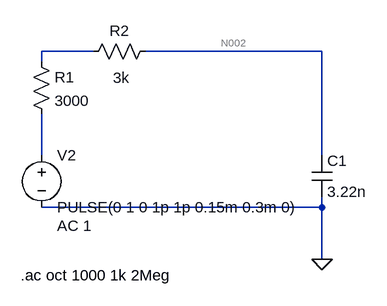
[diagram p0: schematic Draft3.asc]
Draft3.asc, the LTspice schematic file:
Version 4
SHEET 1 1096 680
WIRE 672 -48 592 -48
WIRE 1024 -48 752 -48
WIRE 592 -32 592 -48
WIRE 592 112 592 48
WIRE 1024 112 1024 -48
WIRE 1024 192 1024 176
WIRE 1024 192 592 192
WIRE 1024 272 1024 192
FLAG 1024 272 0
SYMBOL voltage 592 96 R0
WINDOW 123 24 124 Left 2
WINDOW 39 24 124 Left 2
SYMATTR Value2 AC 1
SYMATTR InstName V2
SYMATTR Value PULSE(0 1 0 1p 1p 0.15m 0.3m 0)
SYMBOL res 768 -64 R90
WINDOW 0 0 56 VBottom 2
WINDOW 3 41 53 VTop 2
SYMATTR InstName R2
SYMATTR Value 3k
SYMBOL cap 1008 112 R0
SYMATTR InstName C1
SYMATTR Value 3.22n
SYMBOL res 576 -48 R0
SYMATTR InstName R1
SYMATTR Value 3000
TEXT 560 296 Left 2 !.ac oct 1000 1k 2Meg

The netlist it stands for:
* Draft3.asc
V2 N003 0 PULSE(0 1 0 1p 1p 0.15m 0.3m 0) AC 1
R2 N002 N001 3k
C1 N002 0 3.22n
R1 N001 N003 3000
.ac oct 1000 1k 2Meg
.backanno
.end

* Results of the author's LTspice run, read from the files saved beside the schematic
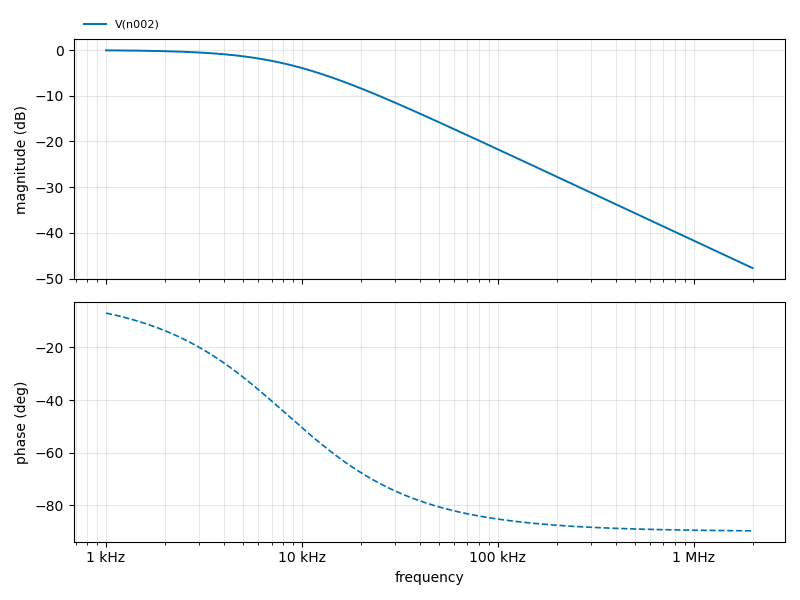
[diagram p1: AC Analysis of Draft3.asc, plotted from the saved traces]
* AC Analysis, 1 run:
*   V(n002): -0.06 dB at 1 kHz, -47.70 dB at 2 MHz, peak -0.06 dB at 1 kHz, 3 dB below the peak at 8.358 kHz